# EAGLE schematic CNMAT-2310 v7 (EAGLE 9.7.0)
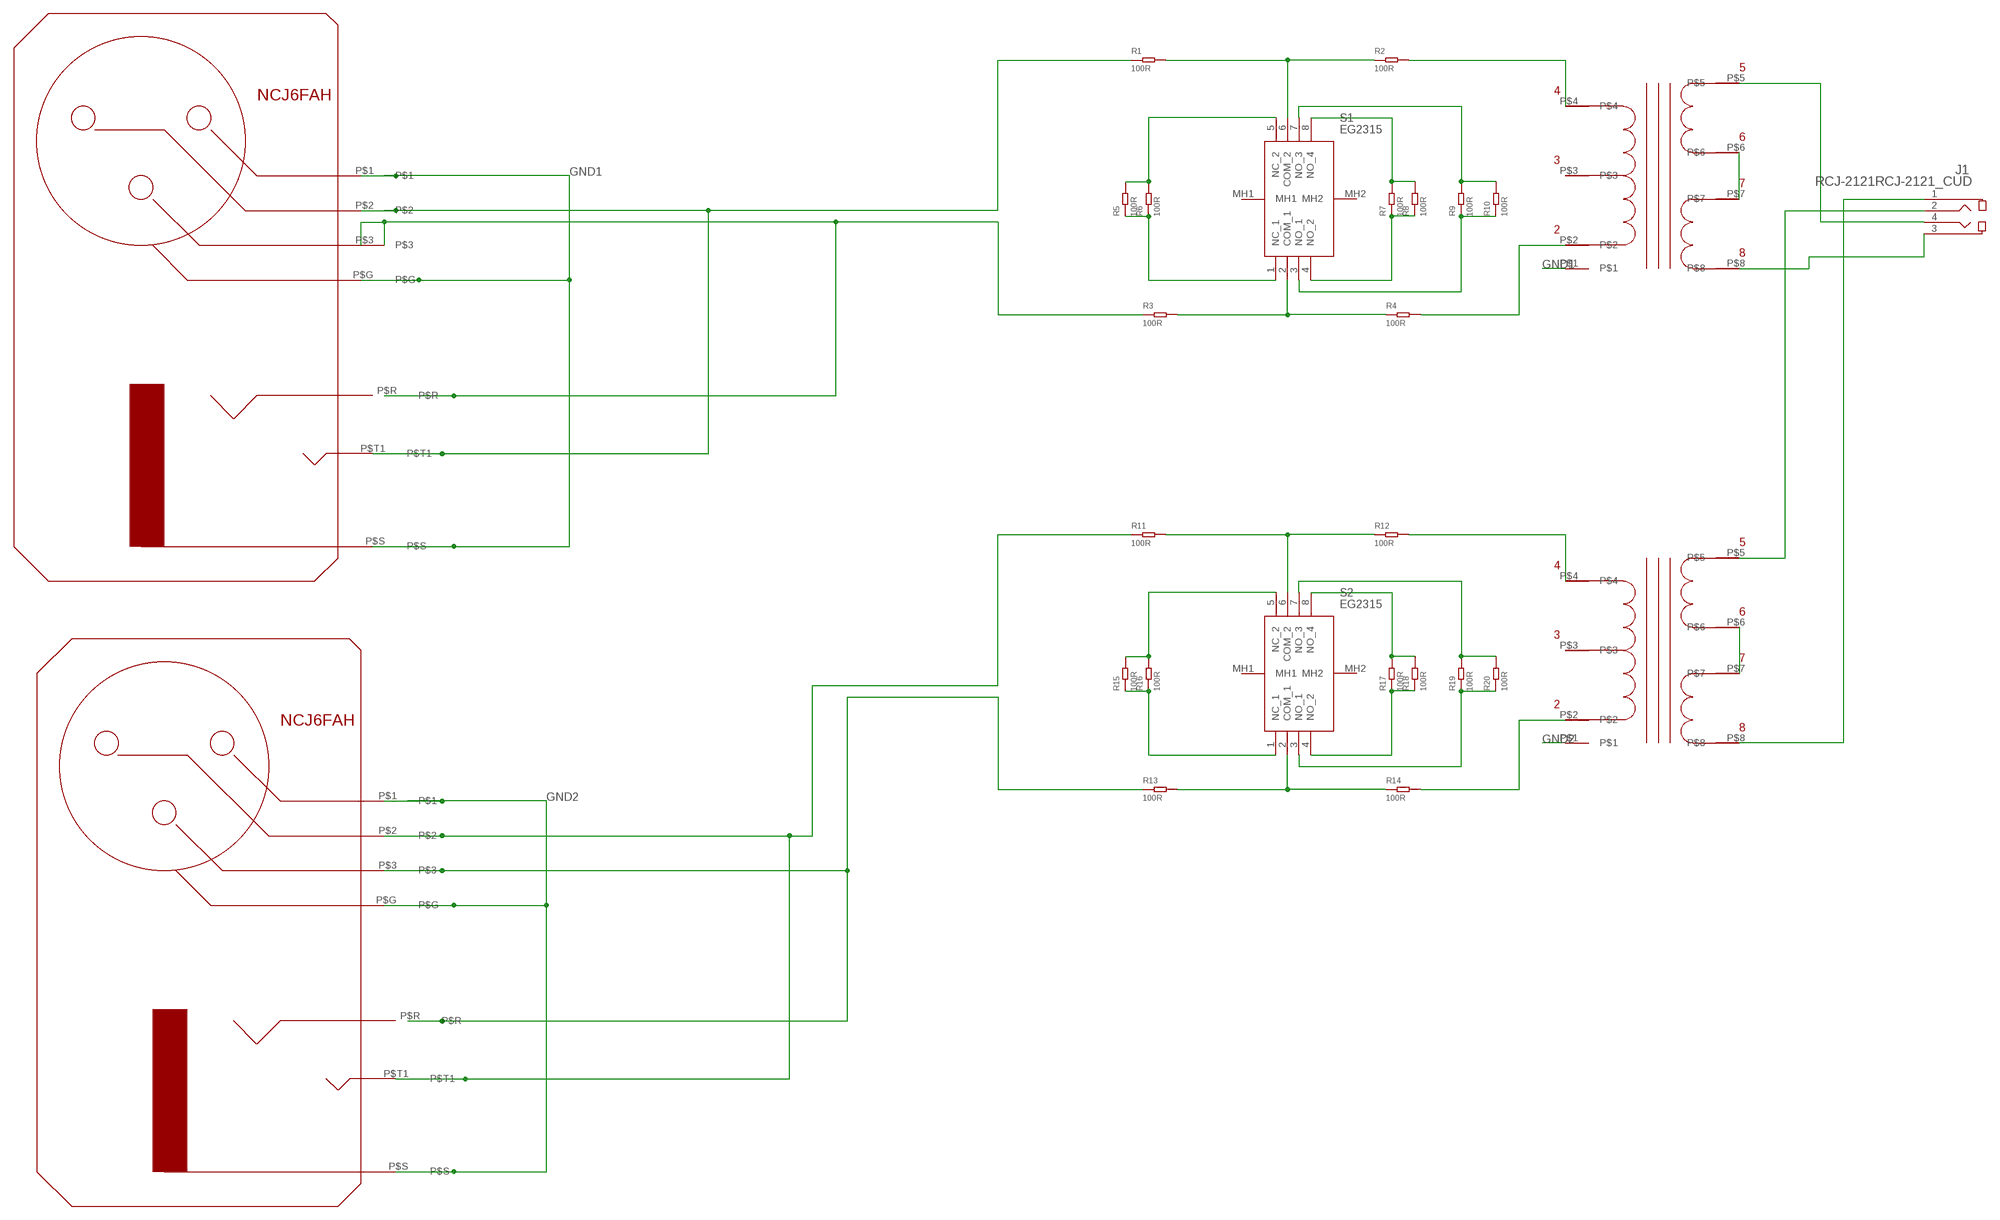
[diagram p0: schematic, sheet 1]

## Parts
J1  RCJ-2121RCJ-2121_CUD  [RCJ-2121_CUD]
R1  100R  DIP-RES-100R-5%-1/4W(PR-D2.3XL6.5MM)  [PR-D2.3XL6.5MM]
R2  100R  DIP-RES-100R-5%-1/4W(PR-D2.3XL6.5MM)  [PR-D2.3XL6.5MM]
R3  100R  DIP-RES-100R-5%-1/4W(PR-D2.3XL6.5MM)  [PR-D2.3XL6.5MM]
R4  100R  DIP-RES-100R-5%-1/4W(PR-D2.3XL6.5MM)  [PR-D2.3XL6.5MM]
R5  100R  DIP-RES-100R-5%-1/4W(PR-D2.3XL6.5MM)  [PR-D2.3XL6.5MM]
R6  100R  DIP-RES-100R-5%-1/4W(PR-D2.3XL6.5MM)  [PR-D2.3XL6.5MM]
R7  100R  DIP-RES-100R-5%-1/4W(PR-D2.3XL6.5MM)  [PR-D2.3XL6.5MM]
R8  100R  DIP-RES-100R-5%-1/4W(PR-D2.3XL6.5MM)  [PR-D2.3XL6.5MM]
R9  100R  DIP-RES-100R-5%-1/4W(PR-D2.3XL6.5MM)  [PR-D2.3XL6.5MM]
R10  100R  DIP-RES-100R-5%-1/4W(PR-D2.3XL6.5MM)  [PR-D2.3XL6.5MM]
R11  100R  DIP-RES-100R-5%-1/4W(PR-D2.3XL6.5MM)  [PR-D2.3XL6.5MM]
R12  100R  DIP-RES-100R-5%-1/4W(PR-D2.3XL6.5MM)  [PR-D2.3XL6.5MM]
R13  100R  DIP-RES-100R-5%-1/4W(PR-D2.3XL6.5MM)  [PR-D2.3XL6.5MM]
R14  100R  DIP-RES-100R-5%-1/4W(PR-D2.3XL6.5MM)  [PR-D2.3XL6.5MM]
R15  100R  DIP-RES-100R-5%-1/4W(PR-D2.3XL6.5MM)  [PR-D2.3XL6.5MM]
R16  100R  DIP-RES-100R-5%-1/4W(PR-D2.3XL6.5MM)  [PR-D2.3XL6.5MM]
R17  100R  DIP-RES-100R-5%-1/4W(PR-D2.3XL6.5MM)  [PR-D2.3XL6.5MM]
R18  100R  DIP-RES-100R-5%-1/4W(PR-D2.3XL6.5MM)  [PR-D2.3XL6.5MM]
R19  100R  DIP-RES-100R-5%-1/4W(PR-D2.3XL6.5MM)  [PR-D2.3XL6.5MM]
R20  100R  DIP-RES-100R-5%-1/4W(PR-D2.3XL6.5MM)  [PR-D2.3XL6.5MM]
S1  EG2315  [EG2315]
S2  EG2315  [EG2315]
U$1  TY-250P  [TY-250P]
U$2  TY-250P  [TY-250P]
U$3  NCJ6FA-H1  [NCJ6FA-H]
U$4  NCJ6FA-H1  [NCJ6FA-H]

## Nets
GND1: U$1.P$1 U$3.P$1 U$3.P$G U$3.P$S
GND2: U$2.P$1 U$4.P$1 U$4.P$G U$4.P$S
N$1: U$2.P$6 U$2.P$7
N$2: R1.1 U$3.P$2 U$3.P$T1
N$3: R3.2 R4.1 S1.2(COM_1)
N$4: R1.2 R2.1 S1.6(COM_2)
N$5: R5.2 R6.2 S1.5(NC_2)
N$6: R5.1 R6.1 S1.1(NC_1)
N$7: R7.2 R8.2 S1.8(NO_4)
N$8: R7.1 R8.1 S1.4(NO_2)
N$9: R9.2 R10.2 S1.7(NO_3)
N$10: R9.1 R10.1 S1.3(NO_1)
N$11: R2.2 U$1.P$4
N$12: R4.2 U$1.P$2
N$13: U$1.P$6 U$1.P$7
N$14: J1.3 U$1.P$8
N$15: J1.4 U$1.P$5
N$16: R3.1 U$3.P$3 U$3.P$R
N$17: R11.1 U$4.P$2 U$4.P$T1
N$19: R13.2 R14.1 S2.2(COM_1)
N$20: R11.2 R12.1 S2.6(COM_2)
N$21: R15.2 R16.2 S2.5(NC_2)
N$22: R15.1 R16.1 S2.1(NC_1)
N$23: R17.2 R18.2 S2.8(NO_4)
N$24: R17.1 R18.1 S2.4(NO_2)
N$25: R19.2 R20.2 S2.7(NO_3)
N$26: R19.1 R20.1 S2.3(NO_1)
N$27: R12.2 U$2.P$4
N$28: R14.2 U$2.P$2
N$30: J1.1 U$2.P$8
N$31: J1.2 U$2.P$5
N$35: R13.1 U$4.P$3 U$4.P$R
Unconnected: S1.MH1 S1.MH2 S2.MH1 S2.MH2 U$1.P$3 U$2.P$3

## Library data of the parts
J1 = RCJ-2121:RCJ-2121; COPYRIGHT: Copyright (C) 2022 Ultra Librarian. All rights reserved.; MANUFACTURER_PART_NUMBER: RCJ-2121; MFR_NAME: CUI Devices
R1-R20 = OPL_Resistor:DIP-RES-100R-5%-1/4W(PR-D2.3XL6.5MM): 301020017; MPN: FHCFR-1/4W-101J
S1 S2 = EG2315:EG2315: Slide Switches SIDE OP PC MNT DP3T Source: Datasheet <https://sten-eswitch-13110800-production.s3.amazonaws.com/system/asset/product_line/data_sheet/119/EG.pdf>; DESCRIPTION: Slide Switches SIDE OP PC MNT DP3T; HEIGHT: 4.7mm; MANUFACTURER_NAME: E-Switch; MANUFACTURER_PART_NUMBER: EG2315
U$1 U$2 = TY-250P:TY-250P
U$3 U$4 = NCJ6FA-H:NCJ6FA-H